# Altium project 红外模块.PrjPcb
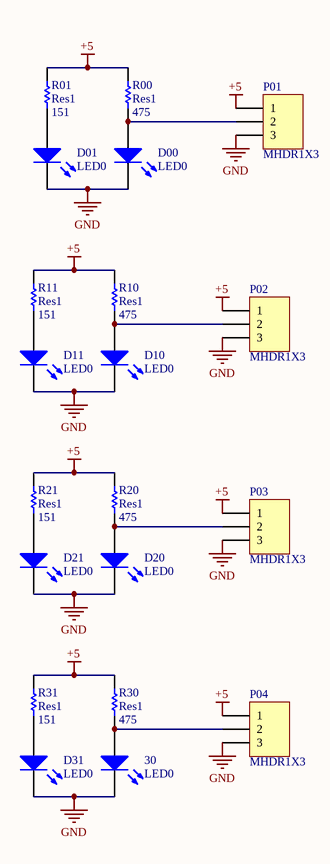
[diagram p0: 红外模块.SchDoc]
1 sheet, 20 parts. Net scope: global (net labels, ports and power ports of the same name join across sheets).

## Sheet 红外模块.SchDoc
size A4; SheetNumber: 1; SheetTotal: 1

### Parts
30  LED0  [LED-0]
D00  LED0  [LED-0]
D01  LED0  [LED-0]
D10  LED0  [LED-0]
D11  LED0  [LED-0]
D20  LED0  [LED-0]
D21  LED0  [LED-0]
D31  LED0  [LED-0]
P01  MHDR1X3  [MHDR1X3]
P02  MHDR1X3  [MHDR1X3]
P03  MHDR1X3  [MHDR1X3]
P04  MHDR1X3  [MHDR1X3]
R00  Res1  value 475  [AXIAL-0.3]
R01  Res1  value 151  [AXIAL-0.3]
R10  Res1  value 475  [AXIAL-0.3]
R11  Res1  value 151  [AXIAL-0.3]
R20  Res1  value 475  [AXIAL-0.3]
R21  Res1  value 151  [AXIAL-0.3]
R30  Res1  value 475  [AXIAL-0.3]
R31  Res1  value 151  [AXIAL-0.3]

### Nets
+5: P01.1 P02.1 P03.1 P04.1 R00.2 R01.2 R10.2 R11.2 R20.2 R21.2 R30.2 R31.2
GND: 30.2(K) D00.2(K) D01.2(K) D10.2(K) D11.2(K) D20.2(K) D21.2(K) D31.2(K) P01.3 P02.3 P03.3 P04.3
Net30_1: 30.1(A) P04.2 R30.1
NetD00_1: D00.1(A) P01.2 R00.1
NetD01_1: D01.1(A) R01.1
NetD10_1: D10.1(A) P02.2 R10.1
NetD11_1: D11.1(A) R11.1
NetD20_1: D20.1(A) P03.2 R20.1
NetD21_1: D21.1(A) R21.1
NetD31_1: D31.1(A) R31.1

### Library data of the parts
30 D00 D01 D10 D11 D20 D21 D31 = LED0: Typical INFRARED GaAs LED; Published: 8-Jun-2000; LatestRevisionDate: 08-Jul-2005; LatestRevisionNote: Mech Layer 1 removed.; PackageReference: LED-0; Publisher: Altium Limited; PackageDescription: LED; 2 Leads
P01 P02 P03 P04 = MHDR1X3: Header, 3-Pin; LatestRevisionDate: 17-Jul-2002; LatestRevisionNote: Re-released for DXP Platform.; Publisher: Altium Limited
R00 R01 R10 R11 R20 R21 R30 R31 = Res1: Resistor; Published: 8-Jun-2000; LatestRevisionDate: 17-Jul-2002; LatestRevisionNote: Re-released for DXP Platform.; PackageReference: AXIAL-0.3; Publisher: Altium Limited; PackageDescription: Axial Device, Thru-Hole; 2 Leads; 0.3 in Pin Spacing